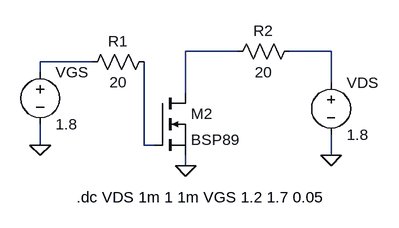
[diagram p0: schematic mosfet.asc]
mosfet.asc, the LTspice schematic file:
Version 4.1
SHEET 1 880 680
WIRE 272 64 192 64
WIRE 416 64 352 64
WIRE 48 80 -32 80
WIRE -32 96 -32 80
WIRE 416 112 416 64
WIRE 192 128 192 64
WIRE -32 208 -32 176
WIRE 128 208 128 80
WIRE 144 208 128 208
WIRE 416 224 416 192
WIRE 192 240 192 224
FLAG -32 208 0
FLAG 416 224 0
FLAG 192 240 0
SYMBOL voltage -32 80 R0
WINDOW 123 0 0 Left 0
WINDOW 39 0 0 Left 0
SYMATTR InstName VGS
SYMATTR Value 1.8
SYMBOL voltage 416 96 R0
WINDOW 123 0 0 Left 0
WINDOW 39 0 0 Left 0
SYMATTR InstName VDS
SYMATTR Value 1.8
SYMBOL nmos 144 128 R0
SYMATTR InstName M2
SYMATTR Value BSP89
SYMBOL res 144 64 R90
WINDOW 0 0 56 VBottom 2
WINDOW 3 32 56 VTop 2
SYMATTR InstName R1
SYMATTR Value 20
SYMBOL res 368 48 R90
WINDOW 0 0 56 VBottom 2
WINDOW 3 32 56 VTop 2
SYMATTR InstName R2
SYMATTR Value 20
TEXT 24 288 Left 2 !.dc VDS 1m 1 1m VGS 1.2 1.7 0.05

The netlist it stands for:
* mosfet.asc
VGS N003 0 1.8
VDS N002 0 1.8
M2 N001 N004 0 0 BSP89
R1 N004 N003 20
R2 N002 N001 20
.model NMOS NMOS
.model PMOS PMOS
.lib standard.mos
.dc VDS 1m 1 1m VGS 1.2 1.7 0.05
.backanno
.end